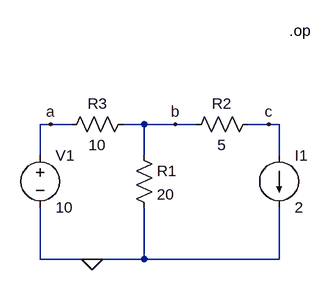
[diagram p0: schematic 250_CW1.asc]
250_CW1.asc, the LTspice schematic file:
Version 4
SHEET 1 880 680
WIRE -16 112 -32 112
WIRE 16 112 -16 112
WIRE 128 112 96 112
WIRE 176 112 128 112
WIRE 208 112 176 112
WIRE 320 112 288 112
WIRE 336 112 320 112
WIRE -32 160 -32 112
WIRE 128 160 128 112
WIRE 336 160 336 112
WIRE -32 320 -32 240
WIRE 48 320 -32 320
WIRE 128 320 128 240
WIRE 128 320 48 320
WIRE 336 320 336 240
WIRE 336 320 128 320
FLAG 48 320 0
FLAG 320 112 c
FLAG 176 112 b
FLAG -16 112 a
SYMBOL res 112 144 R0
SYMATTR InstName R1
SYMATTR Value 20
SYMBOL res 304 96 R90
WINDOW 0 0 56 VBottom 2
WINDOW 3 32 56 VTop 2
SYMATTR InstName R2
SYMATTR Value 5
SYMBOL res 112 96 R90
WINDOW 0 0 56 VBottom 2
WINDOW 3 32 56 VTop 2
SYMATTR InstName R3
SYMATTR Value 10
SYMBOL voltage -32 144 R0
WINDOW 123 0 0 Left 0
WINDOW 39 0 0 Left 0
SYMATTR InstName V1
SYMATTR Value 10
SYMBOL current 336 160 R0
WINDOW 123 0 0 Left 0
WINDOW 39 0 0 Left 0
SYMATTR InstName I1
SYMATTR Value 2
TEXT 352 -32 Left 2 !.op

The netlist it stands for:
* 250_CW1.asc
R1 b 0 20
R2 c b 5
R3 b a 10
V1 a 0 10
I1 c 0 2
.op
.backanno
.end